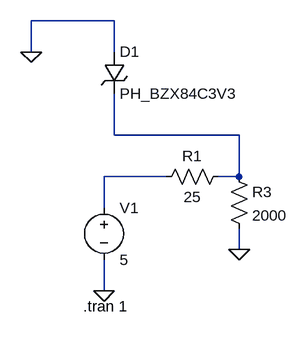
[diagram p0: schematic ADCRefCircuit.asc]
ADCRefCircuit.asc, the LTspice schematic file:
Version 4
SHEET 1 880 680
WIRE -48 -480 -176 -480
WIRE -176 -432 -176 -480
WIRE -48 -432 -48 -480
WIRE -48 -304 -48 -368
WIRE 144 -304 -48 -304
WIRE 32 -240 -64 -240
WIRE 144 -240 144 -304
WIRE 144 -240 112 -240
WIRE -64 -192 -64 -240
WIRE 144 -128 144 -160
WIRE -64 -64 -64 -112
FLAG -64 -64 0
FLAG 144 -128 0
FLAG -176 -432 0
SYMBOL voltage -64 -208 R0
SYMATTR InstName V1
SYMATTR Value 5
SYMBOL res 128 -256 R90
WINDOW 0 0 56 VBottom 2
WINDOW 3 32 56 VTop 2
SYMATTR InstName R1
SYMATTR Value 25
SYMBOL res 128 -256 R0
SYMATTR InstName R3
SYMATTR Value 2000
SYMBOL zener -64 -432 R0
SYMATTR InstName D1
SYMATTR Value PH_BZX84C3V3
TEXT -96 -40 Left 2 !.tran 1

The netlist it stands for:
* ADCRefCircuit.asc
V1 N002 0 5
R1 N001 N002 25
R3 N001 0 2000
D1 0 N001 PH_BZX84C3V3
.model D D
.lib standard.dio
.tran 1
.backanno
.end